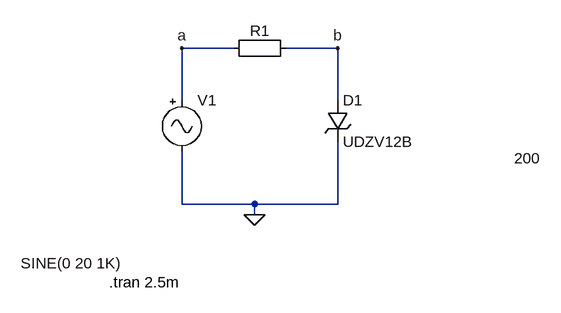
[diagram p0: schematic exp3.asc]
exp3.asc, the LTspice schematic file:
Version 4
SHEET 1 880 680
WIRE 64 -32 -16 -32
WIRE 224 -32 144 -32
WIRE -16 48 -16 -32
WIRE 224 48 224 -32
WIRE -16 208 -16 128
WIRE 96 208 -16 208
WIRE 224 208 224 112
WIRE 224 208 96 208
WIRE 96 224 96 208
FLAG -16 -32 a
FLAG 224 -32 b
FLAG 96 224 0
SYMBOL Misc\\EuropeanResistor 160 -48 R90
WINDOW 0 5 56 VBottom 2
WINDOW 3 170 -356 VTop 2
SYMATTR InstName R1
SYMATTR Value 200
SYMBOL zener 208 48 R0
SYMATTR InstName D1
SYMATTR Value UDZV12B
SYMATTR Description Diode
SYMATTR Type diode
SYMBOL Misc\\signal -16 32 R0
WINDOW 3 -248 267 Left 2
SYMATTR InstName V1
SYMATTR Value SINE(0 20 1K)
TEXT -128 328 Left 2 !.tran 2.5m

The netlist it stands for:
* exp3.asc
R1 b a 200
D1 b 0 UDZV12B
V1 a 0 SINE(0 20 1K)
.model D D
.lib standard.dio
.tran 2.5m
.backanno
.end